# EAGLE design if-455-to-12khz (EAGLE 7.6.0)
123
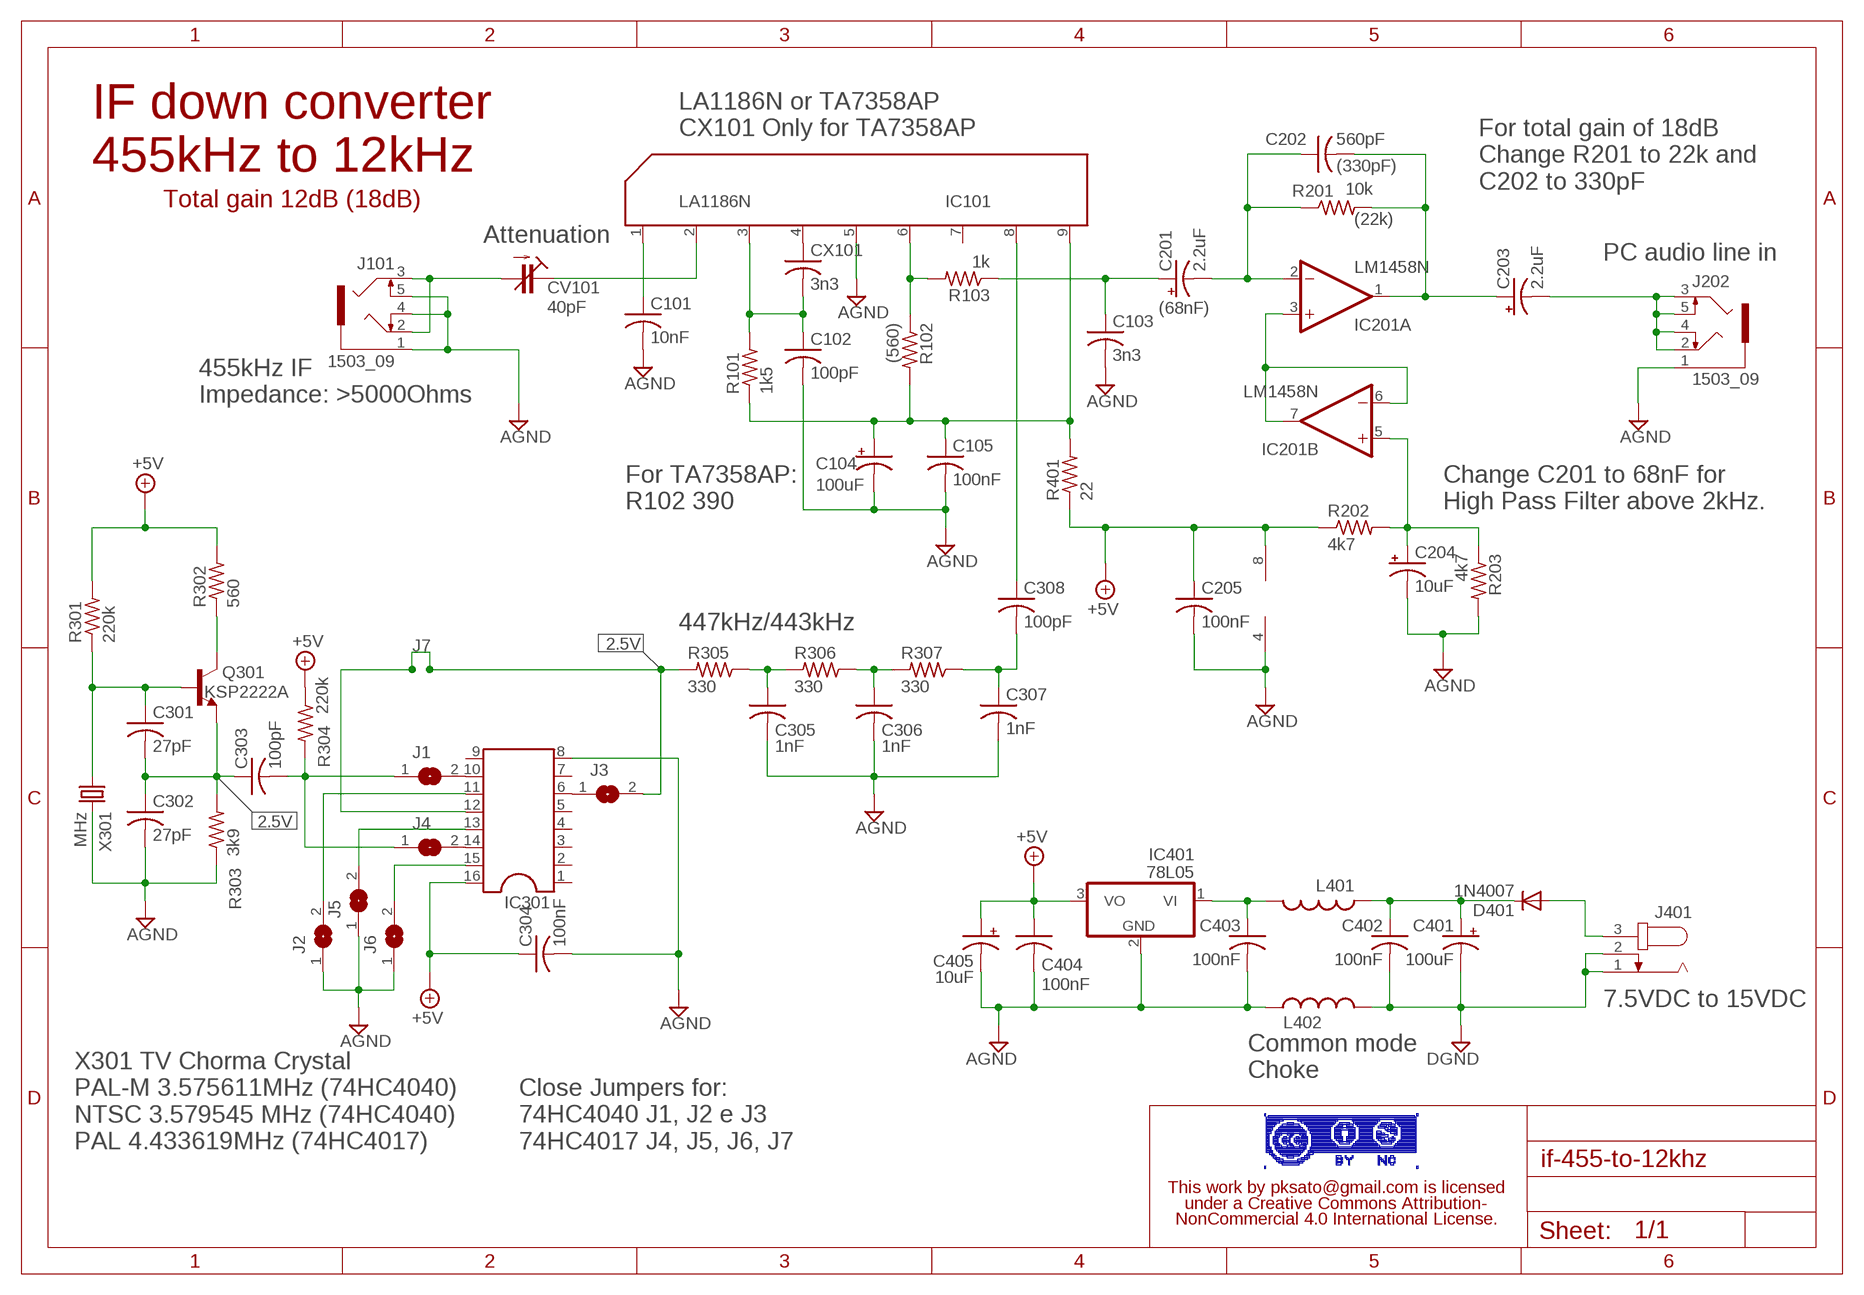
[diagram p0: schematic, sheet 1]

## Parts
C101  10nF  C-US050-025X075  [C050-025X075]
C102  100pF  C-US050-025X075  [C050-025X075]
C103  3n3  C-US050-025X075  [C050-025X075]
C104  100uF  CPOL-USE2.5-5  [E2,5-5]
C105  100nF  C-US050-025X075  [C050-025X075]
C201  2.2uF  CPOL-USE5-5  [E5-5]
C202  560pF  C-US050-025X075  [C050-025X075]
C203  2.2uF  CPOL-USE2.5-5  [E2,5-5]
C204  10uF  CPOL-USE2.5-5  [E2,5-5]
C205  100nF  C-US050-025X075  [C050-025X075]
C301  27pF  C-US050-025X075  [C050-025X075]
C302  27pF  C-US050-025X075  [C050-025X075]
C303  100pF  C-US050-025X075  [C050-025X075]
C304  100nF  C-US050-025X075  [C050-025X075]
C305  1nF  C-US050-025X075  [C050-025X075]
C306  1nF  C-US050-025X075  [C050-025X075]
C307  1nF  C-US050-025X075  [C050-025X075]
C308  100pF  C-US050-025X075  [C050-025X075]
C401  100uF  CPOL-USE2.5-5  [E2,5-5]
C402  100nF  C-US050-025X075  [C050-025X075]
C403  100nF  C-US050-025X075  [C050-025X075]
C404  100nF  C-US050-025X075  [C050-025X075]
C405  10uF  CPOL-USE2.5-5  [E2,5-5]
CV101  40pF  C-TRIMMTZ03  [CTRIMTZ03]
CX101  3n3  C-US025-025X050  [C025-025X050]
D401  1N4007  1N4004  [DO41-10]
IC101  LA1186N  SIP09  [SIP09]
IC201  LM1458N  [DIL08]
IC301  DIL16  [DIL16]
IC401  78L05  78L05L-  [TO92-]
J1  SJ  [SJ]
J2  SJ  [SJ]
J3  SJ  [SJ]
J4  SJ  [SJ]
J5  SJ  [SJ]
J6  SJ  [SJ]
J101  1503_09  [1503_09]
J202  1503_09  [1503_09]
J401  JACK-PLUG0  [SPC4077]
L401  L-US0207/10  [0207/10]
L402  L-US0207/10  [0207/10]
Q301  KSP2222A  2N2222-NPN-TO92-EBC  [TO92-EBC]
R101  1k5  R-US_0207/10  [0207/10]
R102  (560)  R-US_0207/10  [0207/10]
R103  1k  R-US_0207/10  [0207/10]
R201  10k  R-US_0207/10  [0207/10]
R202  4k7  R-US_0207/10  [0207/10]
R203  4k7  R-US_0207/10  [0207/10]
R301  220k  R-US_0207/10  [0207/10]
R302  560  R-US_0207/10  [0207/10]
R303  3k9  R-US_0207/10  [0207/10]
R304  220k  R-US_0207/10  [0207/10]
R305  330  R-US_0207/10  [0207/10]
R306  330  R-US_0207/10  [0207/10]
R307  330  R-US_0207/10  [0207/10]
R401  22  R-US_0207/10  [0207/10]
X301  MHz  CRYSTALHC49U-LM  [HC49U-LM]

## Nets
+5V: C205.1 C304.1 C404.1 C405.+ IC201.8(P:V+) IC301.16 IC401.3(VO) R202.1 R301.2 R302.2 R304.1 R401.1
AGND: C101.2 C102.2 C103.2 C104.- C105.2 C204.- C205.2 C302.2 C304.2 C305.2 C306.2 C307.2 C403.2 C404.2 C405.- IC101.5 IC201.4(P:V-) IC301.8 IC401.2(GND) J2.1 J5.1 J6.1 J101.1 J101.4 J101.5 J202.1 L402.2 R203.2 R303.1 X301.2
DGND: C401.- C402.2 J401.1 J401.2 L402.1
N$1: C301.1 Q301.B R301.1 X301.1
N$2: C301.2 C302.1 C303.1 Q301.E R303.2
N$3: CV101.2(A) J101.2 J101.3
N$4: C101.1 IC101.1
N$5: IC301.12 J3.2 R305.2
N$6: C104.+ C105.1 IC101.9 R101.1 R102.2 R401.2
N$7: C303.2 J1.1 J4.1 R304.2
N$8: C305.1 R305.1 R306.2
N$9: C306.1 R306.1 R307.2
N$12: C102.1 CX101.2 IC101.3 R101.2
N$13: CV101.1(E) IC101.2
N$14: C308.1 IC101.8
N$15: C307.1 C308.2 R307.1
N$16: IC101.6 R102.1 R103.2
N$17: C103.1 C201.+ R103.1
N$18: C403.1 IC401.1(VI) L401.1
N$19: C202.2 C203.+ IC201.1(A:OUT) R201.2
N$20: C201.- C202.1 IC201.2(A:-IN) R201.1
N$21: IC201.3(A:+IN) IC201.6(B:-IN) IC201.7(B:OUT)
N$22: C203.- J202.2 J202.3 J202.4 J202.5
N$23: CX101.1 IC101.4
N$24: Q301.C R302.1
N$25: IC301.14 J4.2
N$26: IC301.10 J1.2
N$27: IC301.11 J2.2
N$28: IC301.15 J6.2
N$29: IC301.13 J5.2
N$30: D401.A J401.3
N$32: IC301.6 J3.1
N$34: C401.+ C402.1 D401.C L401.2
N$38: C204.+ IC201.5(B:+IN) R202.2 R203.1
Unconnected: IC101.7 IC301.1 IC301.2 IC301.3 IC301.4 IC301.5 IC301.7 IC301.9

## Notes on the sheet
- LA1186N or TA7358AP
  CX101 Only for TA7358AP
- IF down converter
  455kHz to 12kHz
- (330pF)
- For total gain of 18dB
  Change R201 to 22k and
  C202 to 330pF
- Total gain 12dB (18dB)
- (22k)
- Attenuation
- PC audio line in
- (68nF)
- 455kHz IF
  Impedance: >5000Ohms
- For TA7358AP:
  R102 390
- Change C201 to 68nF for 
  High Pass Filter above 2kHz.
- 447kHz/443kHz
- J7 | 2.5V
- 2.5V
- 7.5VDC to 15VDC
- Common mode
  Choke
- X301 TV Chorma Crystal
  PAL-M 3.575611MHz (74HC4040)
  NTSC 3.579545 MHz (74HC4040)
  PAL 4.433619MHz (74HC4017)
- Close Jumpers for:
  74HC4040 J1, J2 e J3
  74HC4017 J4, J5, J6, J7
- This work by pksato@gmail.com is licensed
  under a Creative Commons Attribution-
  NonCommercial 4.0 International License.

## Library data of the parts
C101-C103 C105 C202 C205 C301-C308 C402-C404 CX101 = rcl:C-US: CAPACITOR, American symbol
C104 C201 C203 C204 C401 C405 = rcl:CPOL-US: POLARIZED CAPACITOR, American symbol
CV101 = rcl:C-TRIMM: Trimm capacitor
D401 = diode:1N4004: DIODE general purpose rectifier, 1 A
IC101 = my_parts:SIP09: Single In line I.C. Package
IC201 = linear:*1458: OP AMP
IC301 = ic-package:DIL16: Dual In Line / Socket
IC401 = my_parts:78*: Positive VOLTAGE REGULATOR Source: http://cache.national.com/ds/LM/LM78L05.pdf http://www.fairchildsemi.com/ds/LM/LM7805.pdf
J1-J6 = jumper:SJ: SMD solder JUMPER
J101 J202 = con-lumberg:1503_09: Jack connectors according to JISC 6560, 3.5 mm Klinkeneinbaukupplung nach JISC 6560, 3,5 mm, 3-polig/ stereo, abgewinkelte Ausführung, mit 2 Öffnern und Lötaugen, für Leiterplatten Rückseitenmontage Source: http://www.lumberg.com/Produkte/PDFs/1503_09.pdf
J401 = con-jack:JACK-PLUG: DC POWER JACK Power Jack, DC, Right Angle, Through Hole, Rated 5A at 16VDC, PC Terminals Distributor: Farnell (www.Farnell.de) Drawing: 84N1161.pdf / 84N1162.pdf Manufacturer: SPC Technology (www.spctechnology.com) Type: SPC4077 / SPC 4078; OC_FARNELL: unknown; OC_NEWARK: unknown
L401 L402 = rcl:L-US: INDUCTOR, American symbol
Q301 = transistor-neu-to92:*-NPN-: NPN Transistror
R101-R103 R201-R203 R301-R307 R401 = rcl:R-US_: RESISTOR, American symbol
X301 = crystal:CRYSTAL: CRYSTAL; OC_FARNELL: 1666956; OC_NEWARK: unknown

## Board
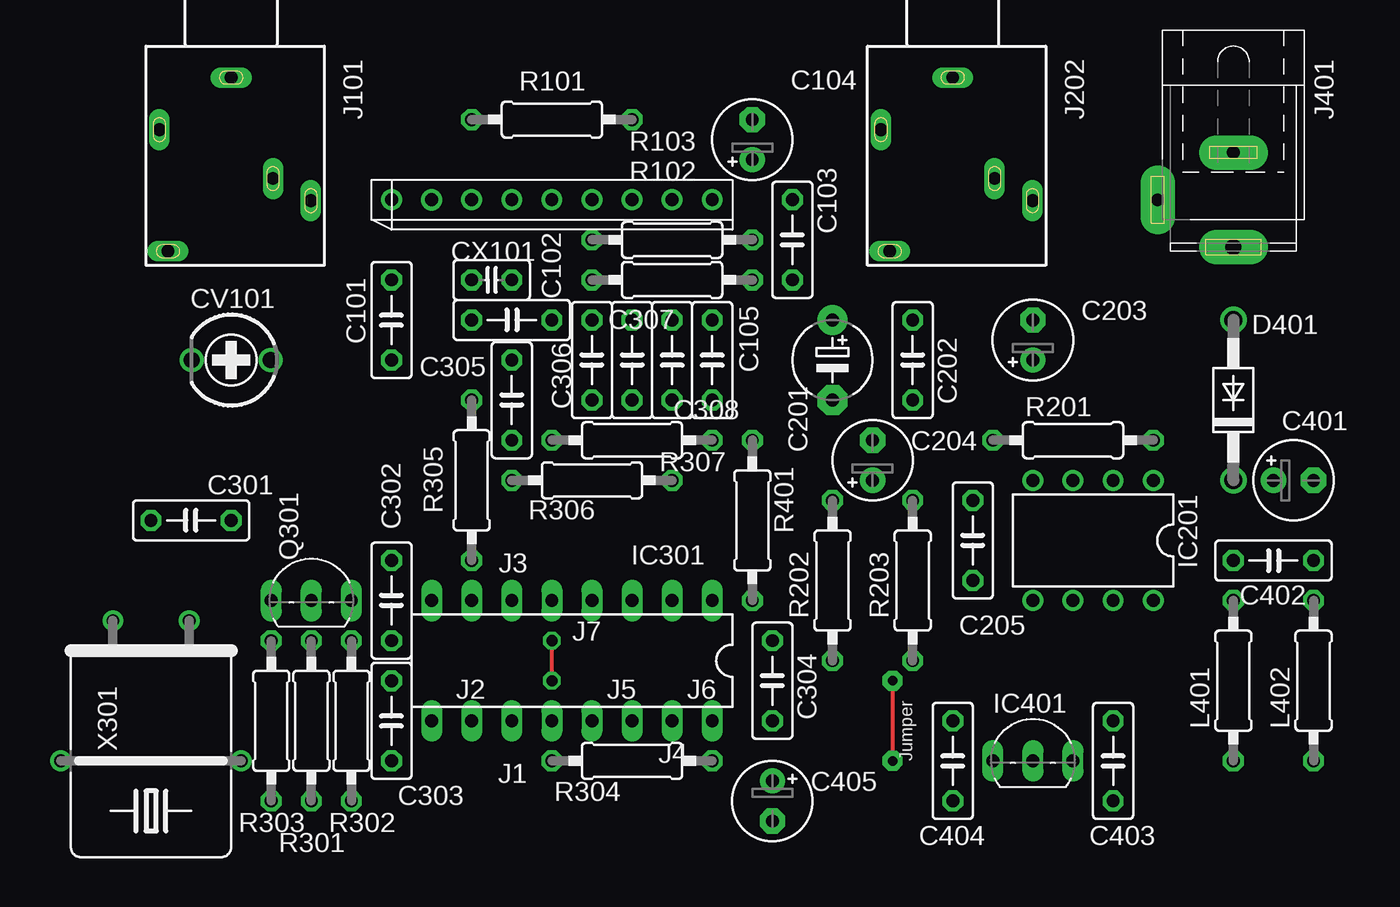
[diagram p1: board, top side]
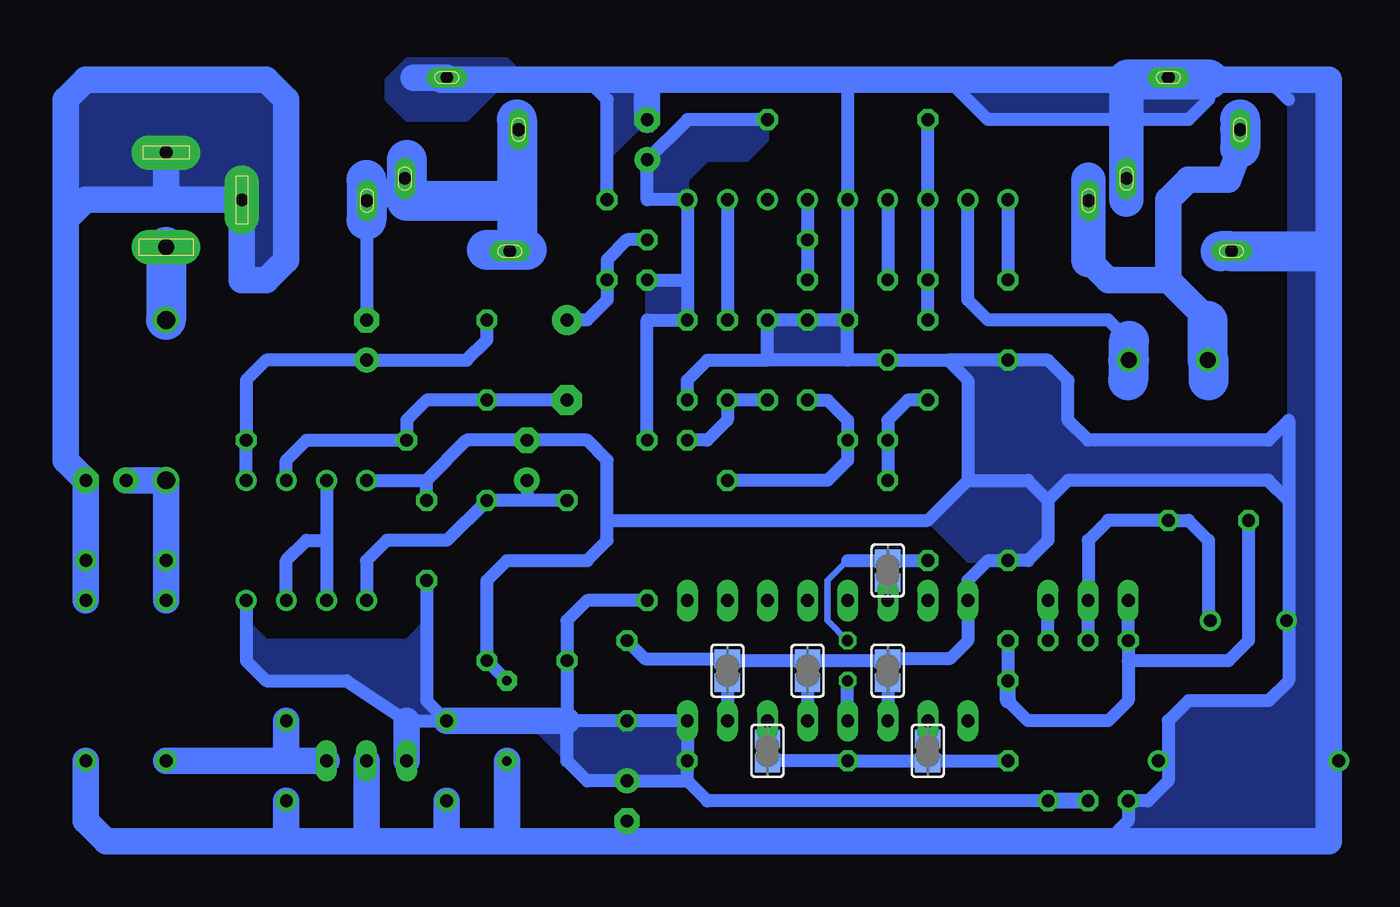
[diagram p2: board, bottom side, seen from below]

No outline drawn. Coordinates in mm, seen from the top.
Copper layers (1*16): Top 0.035mm / dielectric 1.5mm / Bottom 0.035mm
Design rules "default": minimum track width 10mil, minimum drill 24mil, track to track 8mil, track to pad 8mil, pad to pad 8mil, via to via 8mil, smd to smd 8mil, copper to edge 40mil, drill to drill 8mil, minimum pad ring 10mil, minimum via ring 8mil, stop-mask expansion 4mil, vias tented up to drill 0mil, thermal gap 10mil

### Footprints (pad centres in the part's own frame; a part is rotated, then mirrored left to right if it is on the bottom)
C050-025X075 = drill 0.813 octagon: 1 -2.54,0; 2 2.54,0
E2,5-5 = drill 0.813 pad 1.6: + -1.27,0 | drill 0.813 pad 1.6 octagon: - 1.27,0
E5-5 = drill 0.813 pad 1.905: + -2.54,0 | drill 0.813 pad 1.905 octagon: - 2.54,0
CTRIMTZ03 = drill 1: 1 0,2.5; 2 0,-2.5
C025-025X050 = drill 0.813 octagon: 1 -1.27,0; 2 1.27,0
DO41-10 = drill 1.118: A 5.08,0; C -5.08,0
SIP09 = drill 0.813: 1 0,0; 3 5.08,0; 4 7.62,0; 5 10.16,0; 6 12.7,0; 7 15.24,0; 8 17.78,0; 9 20.32,0 | drill 0.838: 2 2.54,0
DIL08 = drill 0.813 pad 1.27: 1 -3.81,-3.81; 2 -1.27,-3.81; 3 1.27,-3.81; 4 3.81,-3.81; 5 3.81,3.81; 6 1.27,3.81; 7 -1.27,3.81; 8 -3.81,3.81
DIL16 = drill 0.813 long: 1 -8.89,-3.81; 2 -6.35,-3.81; 3 -3.81,-3.81; 4 -1.27,-3.81; 5 1.27,-3.81; 6 3.81,-3.81; 7 6.35,-3.81; 8 8.89,-3.81; 9 8.89,3.81; 10 6.35,3.81; 11 3.81,3.81; 12 1.27,3.81; 13 -1.27,3.81; 14 -3.81,3.81; 15 -6.35,3.81; 16 -8.89,3.81
TO92- = drill 0.813 long: 1 2.54,0; 2 0,0; 3 -2.54,0
SJ = smd 1.168 x 1.6: 1 -0.762,0; 2 0.762,0
1503_09 = drill 0.8 pad 1.2 long: 1 0,-2.1; 2 -4.55,-5.4; 3 5.05,-9.9; 4 -4,-13.1; 5 2.65,-8.5
SPC4077 = drill 0.8 pad 2.184 long: 1 -3,0; 2 0,-4.8 | drill 1 pad 2.184 long: 3 3,0
0207/10 = drill 0.813 octagon: 1 -5.08,0; 2 5.08,0
TO92-EBC = drill 0.813 long: B 0,-1.27; C 2.54,-1.27; E -2.54,-1.27
HC49U-LM = drill 0.813: 1 -2.413,-5.08; 2 2.413,-5.08; M -5.715,3.81; M1 5.715,3.81

### Placement (x,y rotation side)
C101  25.4,38.1 270 top
C102  33.02,38.1 0 top
C103  50.8,43.18 90 top
C104  48.26,49.53 90 top
C105  45.72,35.56 270 top
C201  53.34,35.56 270 top
C202  58.42,35.56 90 top
C203  66.04,36.83 90 top
C204  55.88,29.21 90 top
C205  62.23,24.13 90 top
C301  12.7,25.4 180 top
C302  25.4,20.32 90 top
C303  25.4,12.7 270 top
C304  49.53,15.24 90 top
C305  33.02,33.02 90 top
C306  38.1,35.56 90 top
C307  40.64,35.56 90 top
C308  43.18,35.56 270 top
C401  82.55,27.94 0 top
C402  81.28,22.86 0 top
C403  71.12,10.16 270 top
C404  60.96,10.16 270 top
C405  49.53,7.62 270 top
CV101  15.24,35.56 270 top
CX101  31.75,40.64 180 top
D401  78.74,33.02 90 top
IC101  25.4,45.72 0 top
IC201  69.85,24.13 180 top
IC301  36.83,16.51 180 top
IC401  66.04,10.16 0 top
J1  30.48,10.79 90 bottom
J2  33.02,15.88 270 bottom
J3  33.02,22.23 90 bottom
J4  40.64,10.79 90 bottom
J5  38.1,15.88 270 bottom
J6  43.18,15.88 270 bottom
J101  15.24,55.56 0 top
J202  60.96,55.56 0 top
J401  78.74,45.72 270 top
L401  78.74,15.24 90 top
L402  83.82,15.24 270 top
Q301  20.32,21.59 0 top
R101  35.56,50.8 180 top
R102  43.18,40.64 0 top
R103  43.18,43.18 180 top
R201  68.58,30.48 0 top
R202  53.34,21.59 90 top
R203  58.42,21.59 270 top
R301  20.32,12.7 270 top
R302  22.86,12.7 270 top
R303  17.78,12.7 90 top
R304  40.64,10.16 180 top
R305  30.48,27.94 270 top
R306  38.1,27.94 180 top
R307  40.64,30.48 180 top
R401  48.26,25.4 90 top
X301  10.16,13.97 180 top

### Tracks (layer width: path | path; a pad name or v marks a point on that pad's centre or on a via)
+5V
  Bottom 0.813: R302.2 44.45,7.62 45.72,8.89 | 45.72,8.89 R304.1 IC301.16 C304.1 53.34,12.7 | R401.1 52.07,20.32 53.34,19.05 R202.1 53.34,12.7 | 53.34,12.7 53.34,10.16 52.07,8.89 C405.+ 45.72,8.89 | C205.1 62.23,13.97 C404.1 63.5,12.7 67.31,15.24 72.39,15.24 73.66,16.51 IC201.8
  Bottom 1.016: R301.2 R302.2
  Bottom 1.676: C404.1 53.34,12.7 | IC401.3 63.5,12.7
  pour Bottom (no thermals): 45.72,12.7 55.88,12.7 52.07,8.89 45.72,8.89
  pour Bottom (no thermals): 60.96,12.7 62.23,13.97 62.23,19.05 63.5,17.78 72.39,17.78 73.66,19.05 73.66,16.51 72.39,15.24 67.31,15.24 63.5,12.7
AGND  (via drill 0.6 pad 1.27)
  Top 0.254: v57.15,15.24 v57.15,10.16
  Bottom 0.813: 33.15,16.51 J2.1 29.08,16.64 27.94,17.78 IC301.8 27.94,21.59 26.67,22.86 C302.2 24.13,22.86 22.86,24.13 22.86,26.67 | 38.23,16.51 43.18,16.51 J6.1 48.39,16.64 C304.2 | C102.2 IC101.5 35.56,53.34 | C102.2 C306.2 C307.2 40.64,35.56 | 33.02,16.51 33.15,16.51 | 33.15,16.51 38.23,16.51 | 38.23,16.51 J5.1 | 19.05,5.08 17.78,6.35 R303.1 16.51,7.62 15.24,8.89 15.24,12.7 13.97,13.97 8.89,13.97 7.62,15.24 7.62,19.05 | 35.56,35.56 C305.2 29.21,35.56 | 35.56,35.56 C102.2 | 7.62,26.67 7.62,31.75 8.89,30.48 20.32,30.48 21.59,31.75 21.59,34.29 22.86,35.56 C101.2 29.21,35.56 | 7.62,26.67 7.62,19.05 | 7.62,26.67 8.89,27.94 21.59,27.94 22.86,26.67 | X301.2 7.62,19.05 | 52.07,53.34 50.8,52.07 C103.2 | 7.62,52.07 8.89,53.34 | 12.7,53.34 12.7,52.07 13.97,50.8 26.67,50.8 29.21,53.34 | J101.1 15.24,53.34 | 27.94,27.94 24.13,27.94 22.86,26.67 | C105.2 45.72,34.29 44.45,35.56 40.64,35.56 | 35.56,35.56 40.64,35.56 | 29.21,35.56 27.94,34.29 27.94,27.94 | C405.- 49.53,5.08 | v57.15,15.24 R203.2 58.42,21.59 57.15,22.86 52.07,22.86 50.8,24.13 50.8,25.4 | IC201.4 62.23,27.94 | 50.8,25.4 50.8,29.21 52.07,30.48 C204.- 59.69,30.48 62.23,27.94 | 50.8,25.4 30.48,25.4 27.94,27.94 | C205.2 62.23,27.94 | 63.06,53.46 63.18,53.34
  Bottom 1.422: 61.4,53.46 61.28,53.34
  Bottom 1.676: 57.15,5.08 49.53,5.08 19.05,5.08 5.08,5.08 5.08,41.91 | 57.15,5.08 60.96,5.08 | 5.08,41.91 5.08,53.34 8.89,53.34 12.7,53.34 | 48.26,53.34 52.07,53.34 61.28,53.34 | 48.26,53.34 35.56,53.34 29.21,53.34 17.78,53.34 17.89,53.23 | C104.- 48.26,53.34 | 60.96,5.08 66.04,5.08 | 66.04,5.08 71.12,5.08 | 71.12,5.08 82.55,5.08 83.82,6.35 L402.2 | C404.2 60.96,5.08 | v57.15,10.16 57.15,5.08 | J202.1 61.4,53.46 63.06,53.46 | IC401.2 66.04,5.08 | C403.2 71.12,5.08 | 5.63,42.46 5.08,41.91
  Bottom 2.184: 17.89,53.23 J101.5 17.89,45.72
  Bottom 2.54: 12.7,53.34 15.24,53.34 17.78,53.34 | 5.63,42.46 J101.4 11.94,42.46
  pour Bottom (no thermals): 35.56,38.1 40.64,38.1 40.64,35.56 35.56,35.56
  pour Bottom (no thermals): 12.7,53.34 12.7,52.07 13.97,50.8 26.67,50.8 29.21,53.34
  pour Bottom (no thermals): 7.62,52.07 7.62,31.75 8.89,30.48 20.32,30.48 21.59,31.75 21.59,34.29 22.86,35.56 29.21,35.56 27.94,34.29 27.94,27.94 30.48,25.4 27.94,22.86 24.13,22.86 22.86,24.13 22.86,26.67 21.59,27.94 8.89,27.94 7.62,26.67 7.62,15.24 8.89,13.97 13.97,13.97 15.24,12.7 15.24,8.89 16.51,7.62 17.78,7.62 17.78,6.35 19.05,5.08 5.08,5.08 5.08,53.34 8.89,53.34
  pour Bottom (no thermals): 48.26,53.34 48.26,50.8 50.8,48.26 50.8,52.07 52.07,53.34
  pour Bottom (no thermals): 55.88,53.34 57.15,54.61 63.5,54.61 64.77,53.34 64.77,52.07 63.5,50.8 59.69,50.8 57.15,53.34
DGND
  Bottom 1.676: 85.09,44.45 85.09,52.07 83.82,53.34 72.39,53.34 71.12,52.07 71.12,41.91 72.39,40.64 73.94,40.64 J401.2 78.74,45.72 | 85.09,44.45 85.09,29.21 C401.- C402.2 L402.1 | 78.74,45.72 83.82,45.72 85.09,44.45 | J401.1 78.74,45.72
  pour Bottom (no thermals): 73.66,45.72 83.82,45.72 85.09,44.45 85.09,52.07 83.82,53.34 72.39,53.34 71.12,52.07 71.12,41.91 72.39,40.64 73.66,40.64
N$1
  Bottom 0.813: R301.1 Q301.B 20.32,24.13 19.05,25.4 C301.1 13.97,25.4 12.7,24.13 12.7,19.18
  Bottom 1.016: 12.7,19.18 X301.1
N$2
  Bottom 0.813: C302.1 C303.1 | 17.78,16.51 R303.2 Q301.E | 17.78,16.51 17.78,13.97 19.05,12.7 24.13,12.7 25.4,13.97 | C301.2 10.16,17.78 11.43,16.51 17.78,16.51
  Bottom 1.016: 25.4,13.97 C303.1
N$3
  Bottom 1.676: 15.24,40.64 15.24,45.72 13.97,46.99 11.43,46.99 10.69,49 | 15.24,40.64 19.05,40.64 20.32,41.91 | 20.32,45.63 J101.3 | 12.74,38.06 12.7,38.1 15.24,40.64
  Bottom 2.184: 20.32,41.91 20.32,45.63
  Bottom 2.54: CV101.2 12.74,38.06 | 10.69,49 J101.2 10.69,50.8
N$4
  Bottom 0.813: IC101.1 C101.1
N$5  (via drill 0.7)
  Top 0.254: v35.56,15.24 v35.56,17.78
  Bottom 0.406: v35.56,17.78 36.83,19.05 36.83,21.59 35.56,22.86
  Bottom 0.61: J3.2 33.02,22.86 | 33.15,22.86 J3.2 | J3.2 32.89,22.86
  Bottom 0.813: IC301.12 v35.56,15.24 | 35.56,22.86 33.15,22.86 | 32.89,22.86 R305.2
N$6
  Bottom 0.813: 45.72,40.64 IC101.9 48.26,45.72 C104.+ 45.72,50.8 R101.1 | 45.72,40.64 C105.1 48.26,38.1 R401.2 | R102.2 45.72,40.64
  pour Bottom (no thermals): 40.64,49.53 40.64,50.8 45.72,50.8 48.26,48.26 48.26,45.72 45.72,45.72 45.72,46.99 44.45,48.26 41.91,48.26
  pour Bottom (no thermals): 45.72,40.64 48.26,40.64 48.26,38.1 45.72,38.1
N$7
  Bottom 0.813: J4.1 40.64,10.16 R304.2 30.48,10.16 J1.1 30.35,10.16 C303.2
N$8
  Bottom 0.813: R305.1 31.75,33.02 33.02,31.75 C305.1 R306.2
N$9
  Bottom 0.813: C306.1 36.83,33.02 35.56,31.75 R307.2 35.56,29.21 36.83,27.94 R306.1
N$10
  Bottom 2.54: 12.7,35.56 12.7,34.29
N$11
  Bottom 2.54: 17.78,35.56 17.78,34.29
N$12
  Bottom 0.813: C102.1 CX101.2 IC101.3 R101.2
N$13
  Bottom 0.813: 17.74,36.79 19.05,38.1 26.67,38.1 27.94,39.37 IC101.2
  Bottom 2.54: CV101.1 17.74,36.79
N$14
  Bottom 0.813: IC101.8 C308.1
N$15
  Bottom 0.813: C307.1 C308.2 43.18,31.75 44.45,30.48 R307.1
N$16
  Bottom 0.813: IC101.6 R103.2 R102.1
N$17
  Bottom 0.813: R103.1 49.53,43.18 50.8,41.91 C103.1 50.8,39.37 52.07,38.1 C201.+
N$18
  Bottom 1.676: IC401.1 71.12,10.16 | 71.12,10.16 L401.1 | C403.1 71.12,10.16
N$19
  Bottom 0.813: IC201.1 R201.2 73.66,34.29 72.39,35.56 C203.+ 59.69,35.56 58.42,36.83 C202.2
N$20
  Bottom 0.813: IC201.2 71.12,29.21 69.85,30.48 R201.1 63.5,31.75 62.23,33.02 C202.1 C201.-
N$21
  Bottom 0.813: IC201.3 68.58,24.13 | 68.58,24.13 IC201.6 | IC201.7 71.12,22.86 69.85,24.13 68.58,24.13
N$22
  Bottom 0.813: J202.2 56.52,50.8 | 63.5,45.66 J202.3 66.01,38.13 C203.- | 56.52,45.72 56.52,45.66 | J202.5 63.5,47.06 63.5,47.62 | J202.4 56.52,42.46 56.52,43.18
  Bottom 2.54: 56.52,50.8 56.52,45.72 | 56.52,42.55 56.52,43.18 56.52,45.66 63.5,45.66 63.5,47.62 63.5,48.26
N$23
  Bottom 0.813: IC101.4 CX101.1
N$24
  Bottom 0.813: R302.1 Q301.C
N$25
  Bottom 1.016: IC301.14 J4.2
N$26
  Bottom 0.813: IC301.10 J1.2
N$27
  Bottom 0.813: J2.2 IC301.11
N$28
  Bottom 0.813: J6.2 IC301.15
N$29
  Bottom 0.813: J5.2 IC301.13
N$30
  Bottom 2.54: J401.3 D401.A
N$32
  Bottom 0.813: J3.1 IC301.6
N$34
  Bottom 1.676: L401.2 C402.1 D401.C C401.+
N$35
  Bottom 2.184: 20.32,46.99 20.32,45.72
N$38
  Bottom 0.813: R202.2 55.88,26.67 | 55.88,26.67 R203.1 60.96,24.13 64.77,24.13 66.04,22.86 IC201.5 | C204.+ 55.88,26.67
N$40
  Bottom 2.54: 66.04,46.99 66.04,44.45
N$41
  Bottom 2.54: 55.88,42.55 58.42,42.55

### Text on the board
tNames: J7 | Jumper